# EasyEDA Pro project 辅助电源.eprj

# Schematic LMR38020
Board Name: LMR38020; Create Date: 2025-08-12; Page Name: P1; Project Name: 辅助电源; Schematic Name: LMR38020; Update Date: 2025-08-12; Company: 嘉立创EDA; Page Size: A4; Version: V1.0
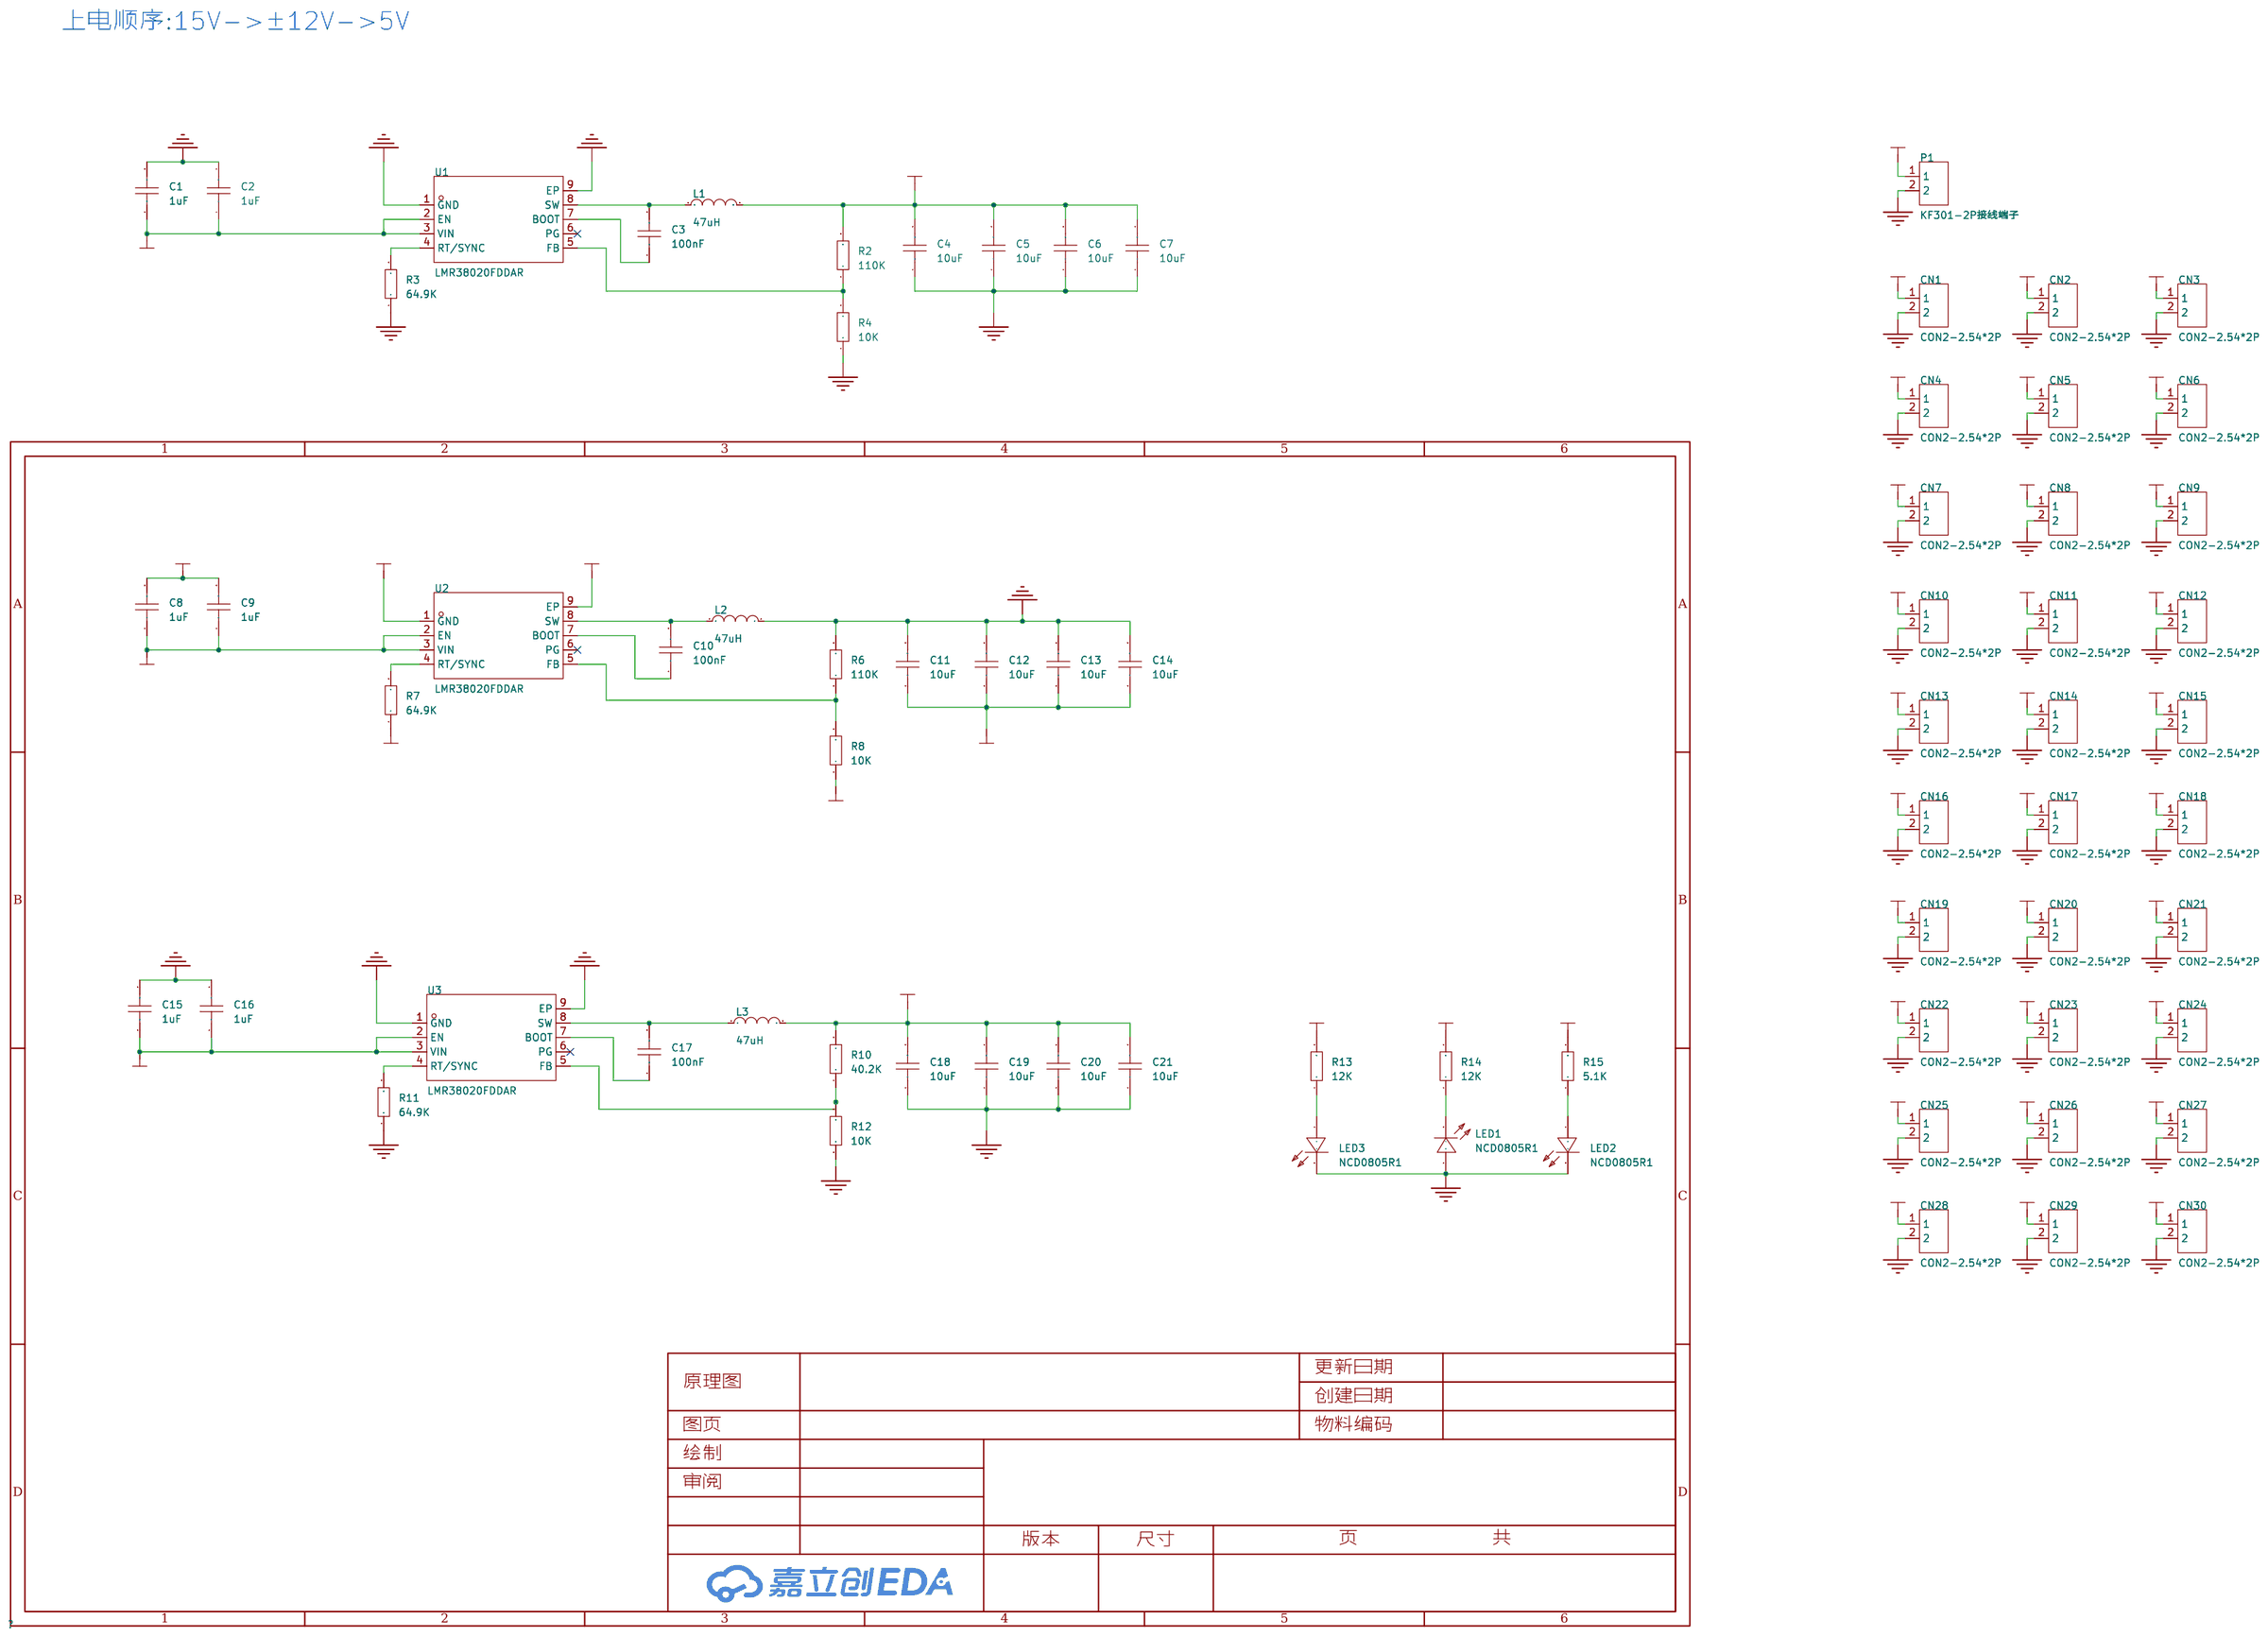
[diagram p0: schematic sheet]

## Parts
C1  1uF  [C1206]
C2  1uF  [C1206]
C3  100nF  [C0805]
C4  10uF  [C1206]
C5  10uF  [C1206]
C6  10uF  [C1206]
C7  10uF  [C1206]
C8  1uF  [C1206]
C9  1uF  [C1206]
C10  100nF  [C0805]
C11  10uF  [C1206]
C12  10uF  [C1206]
C13  10uF  [C1206]
C14  10uF  [C1206]
C15  1uF  [C1206]
C16  1uF  [C1206]
C17  100nF  [C0805]
C18  10uF  [C1206]
C19  10uF  [C1206]
C20  10uF  [C1206]
C21  10uF  [C1206]
CN1  CON2-2.54*2P  [CONN-TH_2P-P2.54-V]
CN2  CON2-2.54*2P  [CONN-TH_2P-P2.54-V]
CN3  CON2-2.54*2P  [CONN-TH_2P-P2.54-V]
CN4  CON2-2.54*2P  [CONN-TH_2P-P2.54-V]
CN5  CON2-2.54*2P  [CONN-TH_2P-P2.54-V]
CN6  CON2-2.54*2P  [CONN-TH_2P-P2.54-V]
CN7  CON2-2.54*2P  [CONN-TH_2P-P2.54-V]
CN8  CON2-2.54*2P  [CONN-TH_2P-P2.54-V]
CN9  CON2-2.54*2P  [CONN-TH_2P-P2.54-V]
CN10  CON2-2.54*2P  [CONN-TH_2P-P2.54-V]
CN11  CON2-2.54*2P  [CONN-TH_2P-P2.54-V]
CN12  CON2-2.54*2P  [CONN-TH_2P-P2.54-V]
CN13  CON2-2.54*2P  [CONN-TH_2P-P2.54-V]
CN14  CON2-2.54*2P  [CONN-TH_2P-P2.54-V]
CN15  CON2-2.54*2P  [CONN-TH_2P-P2.54-V]
CN16  CON2-2.54*2P  [CONN-TH_2P-P2.54-V]
CN17  CON2-2.54*2P  [CONN-TH_2P-P2.54-V]
CN18  CON2-2.54*2P  [CONN-TH_2P-P2.54-V]
CN19  CON2-2.54*2P  [CONN-TH_2P-P2.54-V]
CN20  CON2-2.54*2P  [CONN-TH_2P-P2.54-V]
CN21  CON2-2.54*2P  [CONN-TH_2P-P2.54-V]
CN22  CON2-2.54*2P  [CONN-TH_2P-P2.54-V]
CN23  CON2-2.54*2P  [CONN-TH_2P-P2.54-V]
CN24  CON2-2.54*2P  [CONN-TH_2P-P2.54-V]
CN25  CON2-2.54*2P  [CONN-TH_2P-P2.54-V]
CN26  CON2-2.54*2P  [CONN-TH_2P-P2.54-V]
CN27  CON2-2.54*2P  [CONN-TH_2P-P2.54-V]
CN28  CON2-2.54*2P  [CONN-TH_2P-P2.54-V]
CN29  CON2-2.54*2P  [CONN-TH_2P-P2.54-V]
CN30  CON2-2.54*2P  [CONN-TH_2P-P2.54-V]
L1  47uH  [IND-SMD_L11.5-W10.0_FXL1040]
L2  47uH  [IND-SMD_L11.5-W10.0_FXL1040]
L3  47uH  [IND-SMD_L11.5-W10.0_FXL1040]
LED1  NCD0805R1  [LED0805-R-RD]
LED2  NCD0805R1  [LED0805-R-RD]
LED3  NCD0805R1  [LED0805-R-RD]
P1  KF301-2P接线端子  [CONN-TH_XY301V-A-5.0-2P]
R2  110K  [R0805]
R3  64.9K  [R0805]
R4  10K  [R0805]
R6  110K  [R0805]
R7  64.9K  [R0805]
R8  10K  [R0805]
R10  40.2K  [R0805]
R11  64.9K  [R0805]
R12  10K  [R0805]
R13  12K  [R0805]
R14  12K  [R0805]
R15  5.1K  [R0805]
U1  LMR38020FDDAR  [ESOP-8_L4.9-W3.9-P1.27-LS6.0-BL-EP-1]
U2  LMR38020FDDAR  [ESOP-8_L4.9-W3.9-P1.27-LS6.0-BL-EP-1]
U3  LMR38020FDDAR  [ESOP-8_L4.9-W3.9-P1.27-LS6.0-BL-EP-1]

## Library data of the parts
C1 C2 C8 C9 C15 C16 = 1206B105K101NT: LCSC Part Name: 1uF ±10% 100V; Supplier Part: C91151; Manufacturer: FH(风华); Supplier Footprint: 1206; JLCPCB Part Class: 扩展库; Datasheet: https://atta.szlcsc.com/upload/public/pdf/source/20200305/C486355_26A10D38EF8C2A5C37091D0039909270.pdf; Supplier: LCSC; Tolerance: ±10%; Voltage Rating: 100V; Temperature Coefficient: X7R
C3 C10 C17 = CAP_0805: Supplier Footprint: 0805
C4-C7 C11-C14 C18-C21 = CL31B106KBHNNNE: LCSC Part Name: 10uF ±10% 50V; Supplier Part: C89632; Manufacturer: SAMSUNG(三星); Supplier Footprint: 1206; JLCPCB Part Class: 扩展库; Datasheet: https://atta.szlcsc.com/upload/public/pdf/source/20161130/1480498807789.pdf; Supplier: LCSC; Tolerance: ±10%; Voltage Rated: 50V; Temperature Coefficient: X7R
CN1-CN30 = CON2-2.54*2P: Supplier Part: C9900003238; Supplier Footprint: TH-2P; JLCPCB Part Class: Extended Part; Supplier: LCSC
L1-L3 = FXL1040-470-M: LCSC Part Name: 47uH ±20% 3.5A; Supplier Part: C475919; Manufacturer: cjiang(长江微电); Supplier Footprint: SMD,11.5x10mm; JLCPCB Part Class: 扩展库; Datasheet: https://atta.szlcsc.com/upload/public/pdf/source/20240426/3189EA8206330E2108542F9E34E540E7.pdf; Supplier: LCSC; Tolerance: ±20%; Rated Current: 3.3A; Saturation Current (Isat): 3.5A; DC Resistance (DCR): 145mΩ; Type: 一体成型电感
LED1-LED3 = NCD0805R1: Supplier Part: C84256; Manufacturer: 国星光电; Supplier Footprint: 0805; JLCPCB Part Class: 基础库; Datasheet: https://atta.szlcsc.com/upload/public/pdf/source/20200820/C84256_F0A75A43B3EAD75808600A0514C76B99.pdf; Supplier: LCSC; Emitted Color: 红色; Forward Voltage (VF): 1.6V~2.6V; Power Dissipation: 65mW; Forward Current: 20mA; Dominant Wavelength: 615nm~630nm; Diode Configuration: 独立二极管; Lens Color: 无色透明透镜; Luminous Intensity: 67mcd~195mcd; Viewing Angle: 130°; Operating Temperature: -30℃~+85℃
P1 = KF301-2P接线端子: Supplier Part: C9900016950; Supplier Footprint: CK301-2P; JLCPCB Part Class: Extended Part; Supplier: LCSC
R2-R4 R6-R8 R10-R15 = Res_0805: Supplier Footprint: 0805
U1-U3 = LMR38020FDDAR: LCSC Part Name: 4.2V至80V、2A同步降压转换器; Supplier Part: C5149193; Manufacturer: TI(德州仪器); Supplier Footprint: SO-PowerPAD-8; JLCPCB Part Class: 扩展库; Datasheet: https://www.ti.com/cn/lit/gpn/lmr38020; Supplier: LCSC; Function: 降压型; Voltage - Supply: 4.2V~80V; Output Current: 2A; Frequency - Switching: 525kHz; Operating Temperature: -40℃~+150℃@(TJ); Synchronous Rectifier: 是; Number of Outputs: 1; Switch tube (built-in/external): 内置

## Nets
+5V: C18.2 C19.2 C20.2 C21.2 CN2.1 CN5.1 CN8.1 CN11.1 CN14.1 CN17.1 CN20.1 CN23.1 CN26.1 CN29.1 L3.2 R10.2 R15.2
+12V: C4.2 C5.2 C6.2 C7.2 C8.1 C9.1 CN1.1 CN4.1 CN7.1 CN10.1 CN13.1 CN16.1 CN19.1 CN22.1 CN25.1 CN28.1 L1.2 R2.2 R13.2 U2.2(EN) U2.3(VIN)
-12V: C8.2 C9.2 C11.1 C12.1 C13.1 C14.1 CN3.1 CN6.1 CN9.1 CN12.1 CN15.1 CN18.1 CN21.1 CN24.1 CN27.1 CN30.1 R7.1 R8.1 R14.2 U2.1(GND) U2.9(EP)
GND: C1.2 C2.2 C4.1 C5.1 C6.1 C7.1 C11.2 C12.2 C13.2 C14.2 C15.2 C16.2 C18.1 C19.1 C20.1 C21.1 CN1.2 CN2.2 CN3.2 CN4.2 CN5.2 CN6.2 CN7.2 CN8.2 CN9.2 CN10.2 CN11.2 CN12.2 CN13.2 CN14.2 CN15.2 CN16.2 CN17.2 CN18.2 CN19.2 CN20.2 CN21.2 CN22.2 CN23.2 CN24.2 CN25.2 CN26.2 CN27.2 CN28.2 CN29.2 CN30.2 L2.2 LED1.1(+) LED2.2(-) LED3.2(-) P1.2 R3.1 R4.1 R6.2 R11.1 R12.1 U1.1(GND) U1.9(EP) U3.1(GND) U3.9(EP)
VIN: C1.1 C2.1 C15.1 C16.1 P1.1 U1.2(EN) U1.3(VIN) U3.2(EN) U3.3(VIN)
$1N1152: R3.2 U1.4(RT/SYNC)
$1N1254: C3.2 L1.1 U1.8(SW)
$1N1271: R2.1 R4.2 U1.5(FB)
$1N3207: R11.2 U3.4(RT/SYNC)
$1N3212: C17.2 L3.1 U3.8(SW)
$1N3222: R10.1 R12.2 U3.5(FB)
$1N4033: R6.1 R8.2 U2.5(FB)
$1N4039: C10.2 L2.1 U2.8(SW)
$1N4043: C10.1 U2.7(BOOT)
$1N4065: R7.2 U2.4(RT/SYNC)
$1N6888: C3.1 U1.7(BOOT)
$1N6931: C17.1 U3.7(BOOT)
$1N7217: LED3.1(+) R13.1
$1N7225: LED1.2(-) R14.1
$1N7230: LED2.1(+) R15.1

Not connected (* = marked no-connect by the designer): U1 6(PG)*; U2 6(PG)*; U3 6(PG)*

## Notes on the sheet
- 上电顺序:15V->±12V->5V

# Board LMR38020
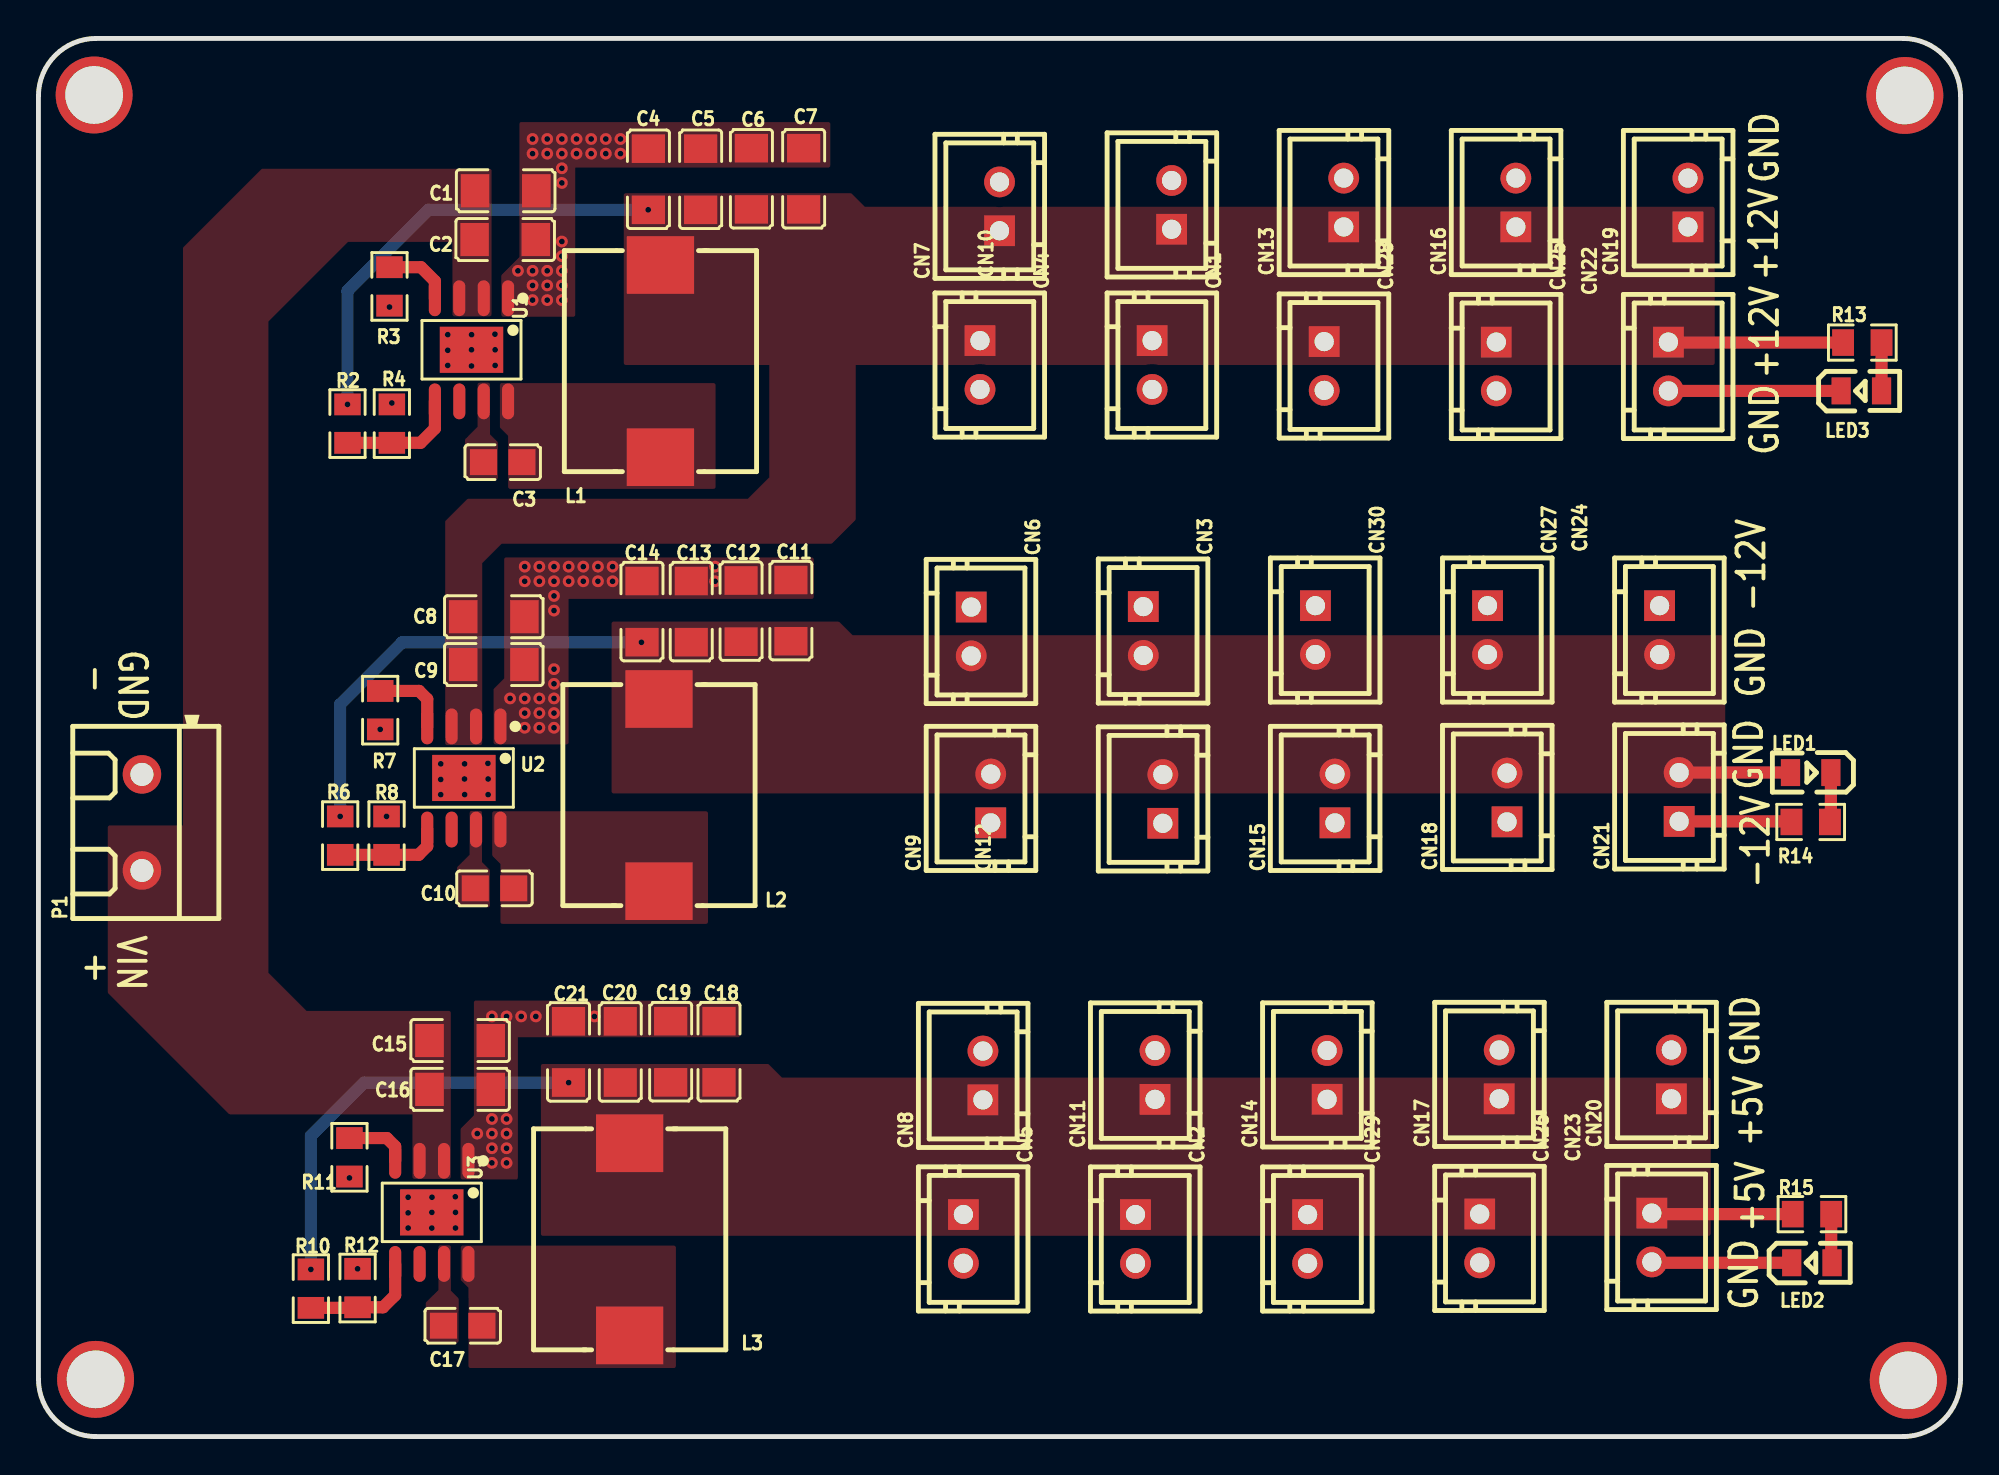
[diagram p1: board, top side]
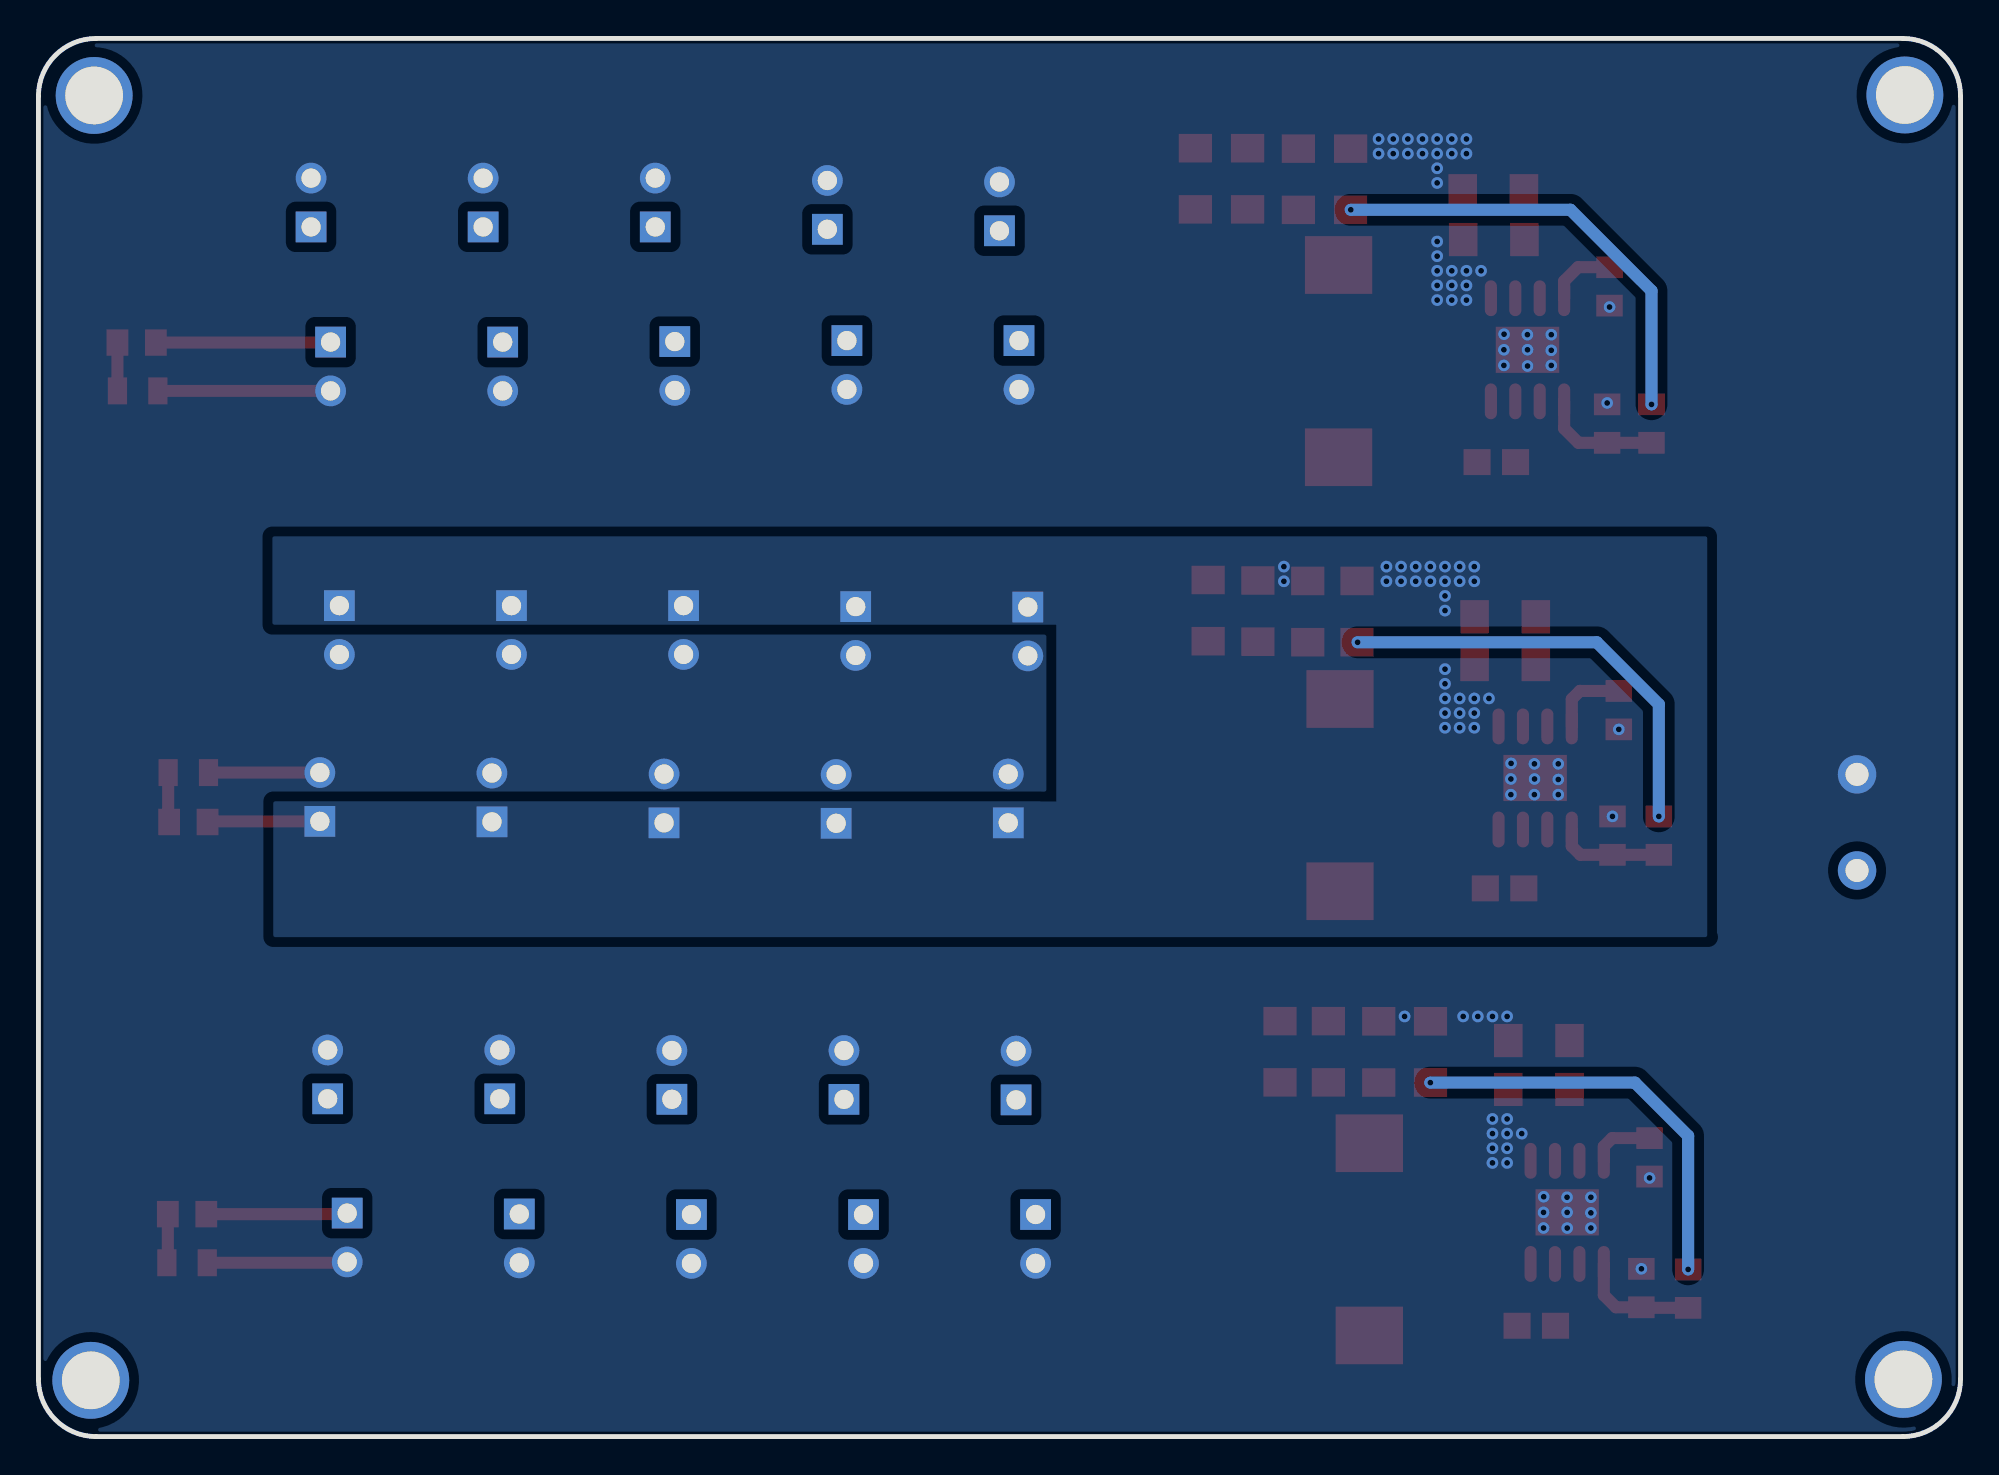
[diagram p2: board, bottom side, seen from below]

Outline 100 x 72.75 mm; copper layers: Top Layer, Bottom Layer. Coordinates in mm from the lower left corner of the outline.
Outline path: 0,69.75 0,3 arc(0.88,0.88) 3,0 97,0 arc(99.12,0.88) 100,3 100,69.75 arc(99.12,71.87) 97,72.75 3,72.75 arc(0.88,71.87) 0,69.75
Stack: Top Layer 0.035mm / Dielectric1 1.51mm FR4 er 4.5 / Bottom Layer 0.035mm

## Design rules (mm)
template: 自定义配置
spacing copperThickness1oz (default): track to track 0.508, other pairs 0.508 to 0.508
spacing copperThickness2oz: track to track 0.203, other pairs 0.152 to 0.3
track width copperThickness1oz (default): min 0.127, default 0.254, max 2.54
track width copperThickness2oz: min 0.203, default 0.254, max 2.54
differential pair differentialPair (default): width min 0.127, default 0.254, max 2.54; gap min 0.152, default 0.152
via viaSize (default): diameter min 0.5, default 0.61, max 10; hole min 0.3, default 0.305, max 6.3

## Placement (name value [footprint] x y rotation side)
C1  1uF  [C1206]  24.31 64.82 0 top
C2  1uF  [C1206]  24.28 62.28 0 top
C3  100nF  [C0805]  24.15 50.7 0 top
C4  10uF  [C1206]  31.73 65.42 270 top
C5  10uF  [C1206]  34.45 65.42 270 top
C6  10uF  [C1206]  37.09 65.44 270 top
C7  10uF  [C1206]  39.81 65.44 270 top
C8  1uF  [C1206]  23.69 42.66 0 top
C9  1uF  [C1206]  23.69 40.17 0 top
C10  100nF  [C0805]  23.72 28.52 0 top
C11  10uF  [C1206]  39.15 42.98 270 top
C12  10uF  [C1206]  36.55 42.95 270 top
C13  10uF  [C1206]  33.96 42.92 270 top
C14  10uF  [C1206]  31.4 42.92 270 top
C15  1uF  [C1206]  21.94 20.6 0 top
C16  1uF  [C1206]  21.94 18.06 0 top
C17  100nF  [C0805]  22.07 5.77 0 top
C18  10uF  [C1206]  35.41 20.02 270 top
C19  10uF  [C1206]  32.89 20.02 270 top
C20  10uF  [C1206]  30.27 20.01 270 top
C21  10uF  [C1206]  27.58 20.01 270 top
CN1  CON2-2.54*2P  [CONN-TH_2P-P2.54-V]  57.94 55.75 270 top
CN2  CON2-2.54*2P  [CONN-TH_2P-P2.54-V]  57.08 10.28 270 top
CN3  CON2-2.54*2P  [CONN-TH_2P-P2.54-V]  57.48 41.91 270 top
CN4  CON2-2.54*2P  [CONN-TH_2P-P2.54-V]  48.99 55.75 270 top
CN5  CON2-2.54*2P  [CONN-TH_2P-P2.54-V]  48.12 10.28 270 top
CN6  CON2-2.54*2P  [CONN-TH_2P-P2.54-V]  48.53 41.89 270 top
CN7  CON2-2.54*2P  [CONN-TH_2P-P2.54-V]  50 64.01 90 top
CN8  CON2-2.54*2P  [CONN-TH_2P-P2.54-V]  49.14 18.79 90 top
CN9  CON2-2.54*2P  [CONN-TH_2P-P2.54-V]  49.54 33.2 90 top
CN10  CON2-2.54*2P  [CONN-TH_2P-P2.54-V]  58.96 64.09 90 top
CN11  CON2-2.54*2P  [CONN-TH_2P-P2.54-V]  58.09 18.81 90 top
CN12  CON2-2.54*2P  [CONN-TH_2P-P2.54-V]  58.5 33.18 90 top
CN13  CON2-2.54*2P  [CONN-TH_2P-P2.54-V]  67.91 64.21 90 top
CN14  CON2-2.54*2P  [CONN-TH_2P-P2.54-V]  67.05 18.82 90 top
CN15  CON2-2.54*2P  [CONN-TH_2P-P2.54-V]  67.45 33.2 90 top
CN16  CON2-2.54*2P  [CONN-TH_2P-P2.54-V]  76.86 64.21 90 top
CN17  CON2-2.54*2P  [CONN-TH_2P-P2.54-V]  76 18.84 90 top
CN18  CON2-2.54*2P  [CONN-TH_2P-P2.54-V]  76.41 33.25 90 top
CN19  CON2-2.54*2P  [CONN-TH_2P-P2.54-V]  85.82 64.21 90 top
CN20  CON2-2.54*2P  [CONN-TH_2P-P2.54-V]  84.95 18.84 90 top
CN21  CON2-2.54*2P  [CONN-TH_2P-P2.54-V]  85.36 33.28 90 top
CN22  CON2-2.54*2P  [CONN-TH_2P-P2.54-V]  84.8 55.68 270 top
CN23  CON2-2.54*2P  [CONN-TH_2P-P2.54-V]  83.94 10.36 270 top
CN24  CON2-2.54*2P  [CONN-TH_2P-P2.54-V]  84.34 41.96 270 top
CN25  CON2-2.54*2P  [CONN-TH_2P-P2.54-V]  75.85 55.68 270 top
CN26  CON2-2.54*2P  [CONN-TH_2P-P2.54-V]  74.98 10.31 270 top
CN27  CON2-2.54*2P  [CONN-TH_2P-P2.54-V]  75.39 41.96 270 top
CN28  CON2-2.54*2P  [CONN-TH_2P-P2.54-V]  66.89 55.7 270 top
CN29  CON2-2.54*2P  [CONN-TH_2P-P2.54-V]  66.03 10.28 270 top
CN30  CON2-2.54*2P  [CONN-TH_2P-P2.54-V]  66.44 41.96 270 top
L1  47uH  [IND-SMD_L11.5-W10.0_FXL1040]  32.36 55.96 90 top
L2  47uH  [IND-SMD_L11.5-W10.0_FXL1040]  32.28 33.38 90 top
L3  47uH  [IND-SMD_L11.5-W10.0_FXL1040]  30.76 10.26 90 top
LED1  NCD0805R1  [LED0805-R-RD]  92.2 34.55 180 top
LED2  NCD0805R1  [LED0805-R-RD]  92.27 9.04 0 top
LED3  NCD0805R1  [LED0805-R-RD]  94.84 54.41 0 top
NOREF  -  [Pad_e2603]  2.97 2.98 0 top
NOREF#2  -  [Pad_e2605]  2.9 69.8 0 top
NOREF#3  -  [Pad_e2606]  97.28 2.93 0 top
NOREF#4  -  [Pad_e2604]  97.1 69.78 0 top
P1  KF301-2P接线端子  [CONN-TH_XY301V-A-5.0-2P]  5.39 31.95 90 top
R2  110K  [R0805]  16.08 52.7 90 top
R3  64.9K  [R0805]  18.26 59.84 90 top
R4  10K  [R0805]  18.39 52.71 270 top
R6  110K  [R0805]  15.7 31.27 90 top
R7  64.9K  [R0805]  17.78 37.8 90 top
R8  10K  [R0805]  18.11 31.27 270 top
R10  40.2K  [R0805]  14.17 7.7 90 top
R11  64.9K  [R0805]  16.18 14.53 90 top
R12  10K  [R0805]  16.6 7.73 270 top
R13  12K  [R0805]  94.89 56.92 180 top
R14  12K  [R0805]  92.2 31.98 180 top
R15  5.1K  [R0805]  92.27 11.57 180 top
U1  LMR38020FDDAR  [ESOP-8_L4.9-W3.9-P1.27-LS6.0-BL-EP-1]  22.53 56.55 180 top
U2  LMR38020FDDAR  [ESOP-8_L4.9-W3.9-P1.27-LS6.0-BL-EP-1]  22.13 34.27 180 top
U3  LMR38020FDDAR  [ESOP-8_L4.9-W3.9-P1.27-LS6.0-BL-EP-1]  20.46 11.66 180 top

## Footprints (pads in the part's own frame, mm; a bottom-side part is the same pattern mirrored in y, then rotated)
C0805
  rect 1.41x1.35 smd: 1(-1,0) 2(1,0)
C1206
  rect 1.485x1.728 smd: 1(-1.593,0) 2(1.593,0)
CONN-TH_2P-P2.54-V
  rect 1.6x1.6 hole 1: 1(-1.27,0)
  round 1.6 hole 1: 2(1.27,0)
CONN-TH_XY301V-A-5.0-2P
  round 2 hole 1.2: 1(-2.5,0) 2(2.5,0)
ESOP-8_L4.9-W3.9-P1.27-LS6.0-BL-EP-1
  oval 0.63x1.865 smd: 1(-1.905,-2.683) 2(-0.635,-2.683) 3(0.635,-2.683) 4(1.905,-2.683) 5(1.905,2.683) 6(0.635,2.683) 7(-0.635,2.683) 8(-1.905,2.683)
  rect 3.3x2.4 smd: 9(0,0)
IND-SMD_L11.5-W10.0_FXL1040
  rect 3x3.5 smd: 1(-5,0) 2(5,0)
LED0805-R-RD
  rect 1x1.399 smd: 1(1.05,0) 2(-1.05,0)
Pad_e2603
  round 4 hole 3: 1(0,0)
Pad_e2604
  round 4 hole 3: 1(0,0)
Pad_e2605
  round 4 hole 3: 1(0,0)
Pad_e2606
  round 4 hole 3: 1(0,0)
R0805
  rect 1.133x1.377 smd: 1(-1,0) 2(1,0)

## Nets
As in the schematic.

Pads without a net: NOREF 1; NOREF#2 1; NOREF#3 1; NOREF#4 1; U1 6; U2 6; U3 6

## Via types
v1: diameter 0.61, hole 0.305, Top Layer to Bottom Layer, 111 vias

## Routing (per net, layer and track width the routed paths; a pad name or vN(x,y) marks a point on that pad's centre or on a via; arc(x,y) is an arc through that point)
+5V: length 28.9
  Top Layer w0.63: R15.2 83.99,11.57 CN23.1
  Bottom Layer w0.63: v1(14.17,8.7) 14.17,15.65 16.94,18.42 v1(27.58,18.42)
+12V: length 32.4
  Top Layer w0.63: R13.2 84.83,56.92 CN22.1
  Bottom Layer w0.63: v1(16.08,53.7) 16.08,59.61 20.3,63.83 v1(31.73,63.83)
-12V: length 5.9
  Top Layer w0.63: CN21.1 91.17,32.01 R14.2
  vias: v1(17.78,36.8) v1(18.11,32.27) v1(20.93,35) v1(20.93,34.19) v1(20.93,33.4) v1(22.17,35) v1(22.17,34.21) v1(22.17,33.4) v1(23.39,35.03) v1(23.39,34.21) v1(23.39,33.4) v1(24.54,38.41) v1(25.3,45.26) v1(25.3,44.5) v1(25.3,38.41) v1(25.3,37.64) v1(25.3,36.88) v1(26.06,45.26) v1(26.06,44.5) v1(26.06,38.41) v1(26.06,37.64) v1(26.06,36.88) v1(26.82,45.26) v1(26.82,44.5) v1(26.82,43.74) v1(26.82,42.98) v1(26.82,39.93) v1(26.82,39.17) v1(26.82,38.41) v1(26.82,37.64) v1(26.82,36.88) v1(27.58,45.26) v1(27.58,44.5) v1(28.35,45.26) v1(28.35,44.5) v1(29.11,45.26) v1(29.11,44.5) v1(29.87,45.26) v1(29.87,44.5) v1(35.2,45.26) v1(35.2,44.5)
GND: length 44.9
  Top Layer w0.63: LED1.1 91.15,34.55 CN21.2 ; LED3.2 CN22.2 ; CN23.2 83.98,9.04 LED2.2
  Bottom Layer w0.63: v1(15.7,32.27) 15.7,38.1 18.92,41.33 v1(31.37,41.33)
  vias: v1(16.18,13.46) v1(16.6,8.73) v1(18.26,58.77) v1(18.39,53.78) v1(19.23,12.45) v1(19.23,11.64) v1(19.23,10.85) v1(20.47,12.45) v1(20.47,11.66) v1(20.46,10.85) v1(21.29,57.33) v1(21.29,56.52) v1(21.29,55.73) v1(21.69,12.48) v1(21.7,11.66) v1(21.7,10.85) v1(22.54,57.33) v1(22.53,56.55) v1(22.53,55.7) v1(22.83,15.76) v1(23.59,21.86) v1(23.59,16.53) v1(23.59,15.76) v1(23.59,15) v1(23.59,14.24) v1(23.75,57.36) v1(23.76,56.55) v1(23.76,55.73) v1(24.35,21.86) v1(24.35,16.53) v1(24.35,15.76) v1(24.35,15) v1(24.35,14.24) v1(24.95,60.66) v1(25.12,21.86) v1(25.71,67.51) v1(25.71,66.75) v1(25.71,60.66) v1(25.71,59.89) v1(25.71,59.13) v1(25.88,21.86) v1(26.47,67.51) v1(26.47,66.75) v1(26.47,60.66) v1(26.47,59.89) v1(26.47,59.13) v1(27.23,67.51) v1(27.23,66.75) v1(27.23,65.99) v1(27.23,65.23) v1(27.23,62.18) v1(27.23,61.42) v1(27.23,60.66) v1(27.23,59.89) v1(27.23,59.13) v1(27.99,67.51) v1(27.99,66.75) v1(28.76,67.51) v1(28.76,66.75) v1(28.93,21.86) v1(29.52,67.51) v1(29.52,66.75) v1(30.28,67.51) v1(30.28,66.75)
$1N1152: length 3.6
  Top Layer w0.63: U1.4 20.62,60.12 19.9,60.84 R3.2
$1N1271: length 6.3
  Top Layer w0.63: U1.5 20.62,52.45 19.88,51.71 R4.2 R2.1
$1N3207: length 3.3
  Top Layer w0.63: U3.4 18.56,15.1 18.13,15.53 R11.2
$1N3222: length 6.3
  Top Layer w0.63: U3.5 18.56,7.36 17.93,6.73 R12.2 16.57,6.7 R10.1
$1N4033: length 5.6
  Top Layer w0.63: R6.1 R8.2 19.78,30.27 20.23,30.72 U2.5
$1N4065: length 4
  Top Layer w0.63: U2.4 20.23,38.37 19.8,38.8 R7.2
$1N7217: length 2.5
  Top Layer w0.63: R13.1 LED3.1
$1N7225: length 2.6
  Top Layer w0.63: LED1.2 93.25,32.03 R14.1
$1N7230: length 2.5
  Top Layer w0.63: R15.1 93.27,9.09 LED2.1

## Copper pours and planes (outline as drawn; the poured copper is in the pictures)
+5V on Top Layer: 26.14,19.41 26.14,10.44 87,10.44 87,18.67 38.69,18.67 37.98,19.38 26.17,19.38
+12V on Top Layer: 30.45,64.72 30.45,55.75 87.21,55.75 87.21,63.98 43,63.98 42.29,64.69 30.48,64.69
+12V on Top Layer: 21.16,35.94 21.16,47.62 22.33,48.79 36.91,48.79 38.02,49.91 38.02,57.45 38,57.48 42.49,57.48 42.52,57.45 42.52,47.7 41.27,46.46 24.11,46.46 23.09,45.44 23.09,35.94
-12V on Top Layer: 23.67,38.89 24.23,39.45 24.23,45.74 40.33,45.74 40.33,43.58 27.58,43.58 27.58,36.02 23.67,36.02
-12V on Bottom Layer: 13.18,46.84 13.18,26.03 13.13,25.98 87.78,25.98 87.78,33.05 47.86,33.05 47.85,33.05 47.05,33.05 47.05,42.24 87.83,42.24 87.83,46.84
GND on Top Layer: 27.93,66.03 27.93,61.11 27.93,58.27 24.08,58.27 24.08,60.43 25.02,61.37 25.02,68.4 25.03,68.39 41.2,68.39 41.2,66.03
GND on Top Layer: 29.81,42.43 29.81,33.46 87.75,33.46 87.75,41.69 42.36,41.69 41.65,42.4 29.84,42.4
GND on Top Layer: 21.94,15.99 22.66,16.71 22.66,22.66 22.68,22.68 36.53,22.68 36.5,22.66 36.5,20.78 24.94,20.78 24.94,13.41 24.91,13.38 21.94,13.38
GND on Bottom Layer: -0.36,73.05 100.41,73.05 100.41,-0.56 -0.36,-0.56
VIN on Top Layer: 3.61,31.8 7.52,31.8 7.52,61.86 11.62,65.96 23.57,65.96 23.57,58.29 21.55,58.29 21.54,58.3 21.54,62.15 16.1,62.15 11.96,58.01 11.96,24.13 13.95,22.15 21.46,22.15 21.46,13.4 19.46,13.4 19.46,16.76 9.93,16.76 3.61,23.09
$1N1254 on Top Layer: 24,54.81 24,52.5 24.44,52.07 24.44,49.31 35.23,49.31 35.23,54.81
$1N3212 on Top Layer: 21.94,9.93 21.94,8.18 22.37,7.75 22.37,3.57 33.16,3.57 33.16,9.93
$1N4039 on Top Layer: 23.61,32.53 23.61,30.22 24.04,29.79 24.04,26.68 34.83,26.68 34.83,32.53
$1N4043 on Top Layer: 22.43,32.6 22.43,30.28 21.77,29.62 21.77,27.58 21.82,27.53 23.49,27.53 23.49,29.48 23.08,29.89 23.08,32.6
$1N6888 on Top Layer: 22.84,54.86 22.84,52.54 22.19,51.88 22.19,49.84 22.23,49.8 23.9,49.8 23.9,51.74 23.5,52.15 23.5,54.86
$1N6931 on Top Layer: 20.81,9.95 20.81,7.63 20.15,6.97 20.15,4.93 20.2,4.88 21.87,4.88 21.87,7.18 21.46,7.59 21.46,9.95

## Text on the board
Top Silkscreen Layer: + | - | GND | +5V | -12V | +12V | VIN
